# Altium schematic sheet MCU+GPIO.SchDoc
size 420 x 297 mm; SheetNumber: 1; SheetTotal: 2
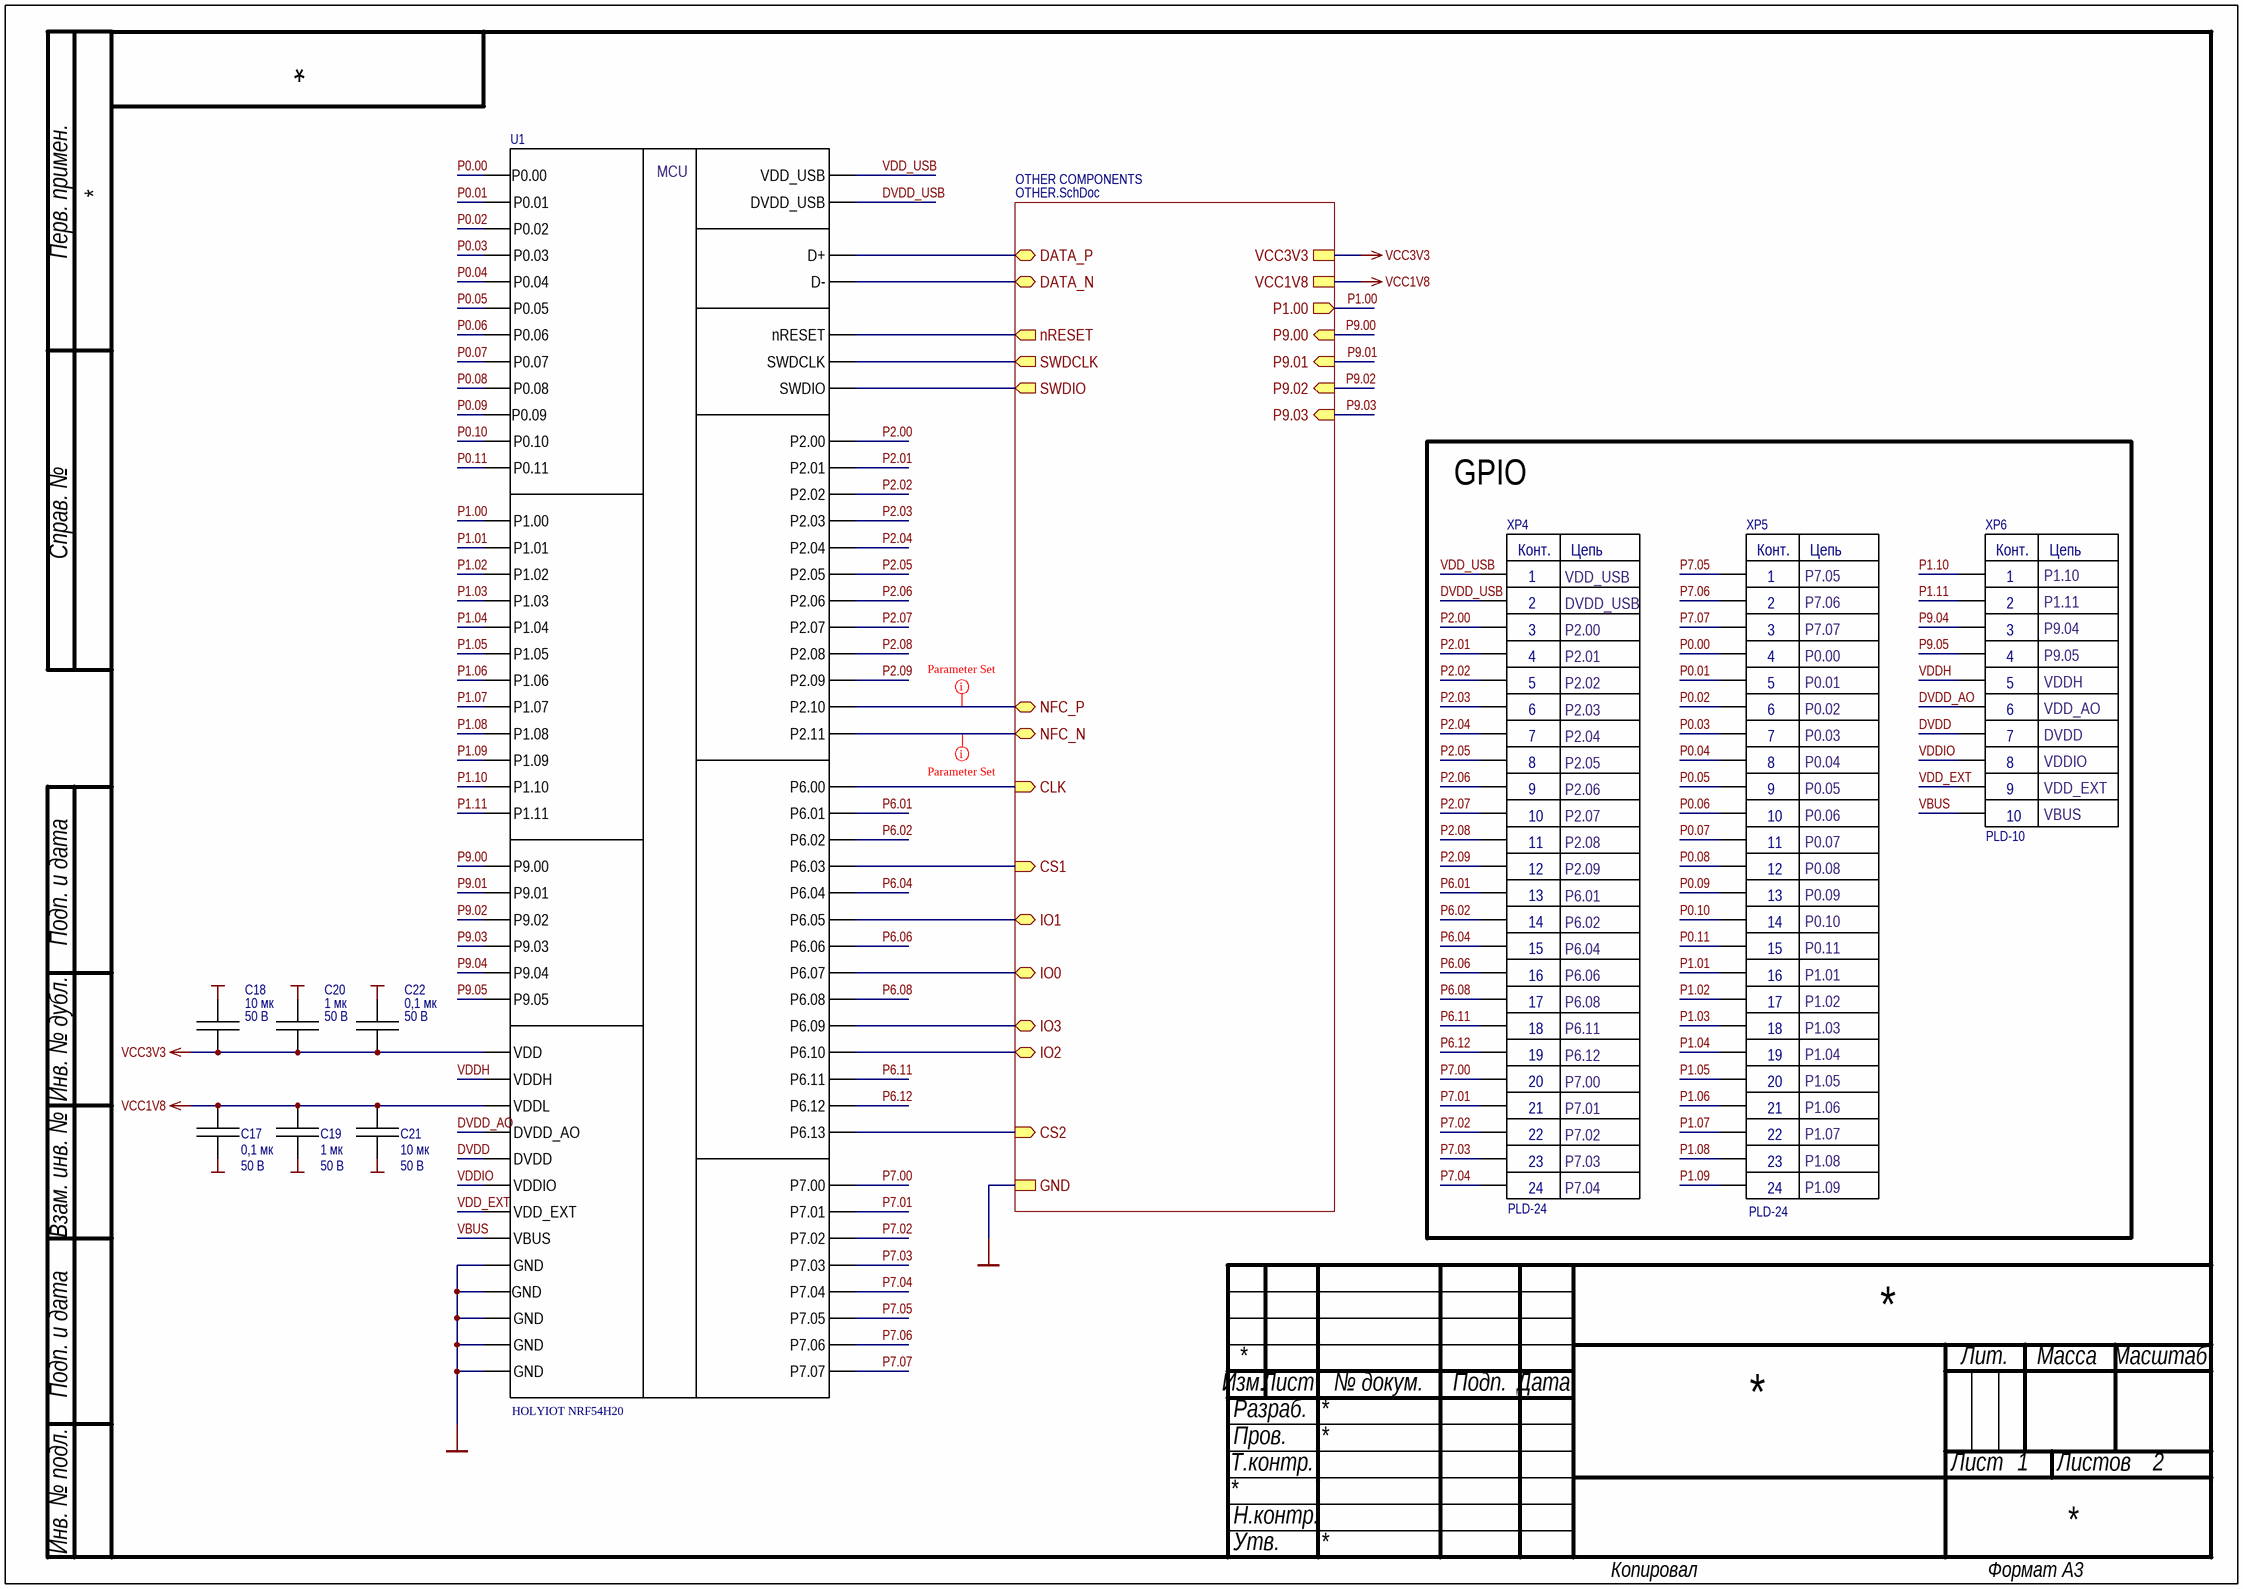
[diagram p0: MCU+GPIO.SchDoc]

## Parts
C17  value 0,1 мк  Rated voltage: 50 В  [C_0603_Manual_mount]  (hidden comment: GRM188R71H104KA93)
C18  value 10 мк  Rated voltage: 50 В  [C_1210_Manual_mount]  (hidden comment: GRM32ER61H106MA12)
C19  value 1 мк  Rated voltage: 50 В  [C_1206_Manual_mount]  (hidden comment: GRM31MR71H105KA88)
C20  value 1 мк  Rated voltage: 50 В  [C_1206_Manual_mount]  (hidden comment: GRM31MR71H105KA88)
C21  value 10 мк  Rated voltage: 50 В  [C_1210_Manual_mount]  (hidden comment: GRM32ER61H106MA12)
C22  value 0,1 мк  Rated voltage: 50 В  [C_0603_Manual_mount]  (hidden comment: GRM188R71H104KA93)
U1  HOLYIOT NRF54H20  [HOLYIOT NRF54H20]
XP4  PLD-24  [PLD-24]
XP5  PLD-24  [PLD-24]
XP6  PLD-10  [PLD-10]

## Blocks framed on the sheet
GPIO: XP4-XP6

## Sub-sheets
OTHER COMPONENTS = OTHER.SchDoc: DATA_P (bidir), DATA_N (bidir), NFC_N (bidir), NFC_P (bidir), SWDIO (out), SWDCLK (out), CLK (in), CS1 (in), CS2 (in), IO0 (bidir), IO1 (bidir), IO2 (bidir), IO3 (bidir), P1.00 (out), nRESET (out), P9.00 (in), P9.01 (in), P9.02 (in), P9.03 (in), GND, VCC3V3, VCC1V8

## Nets
GND: C17.2 C18.2 C19.2 C20.2 C21.2 C22.2 U1.1(GND) U1.4(GND) U1.28(GND) U1.29(GND) U1.58(GND) ; sheet OTHER COMPONENTS/GND
VCC1V8: C17.1 C19.1 C21.1 U1.55(VDDL) ; sheet OTHER COMPONENTS/VCC1V8
VCC3V3: C18.1 C20.1 C22.1 U1.3(VDD) ; sheet OTHER COMPONENTS/VCC3V3
DVDD: U1.5(DVDD) XP6.7
DVDD_AO: U1.6(DVDD_AO) XP6.6
DVDD_USB: U1.76(DVDD_USB) XP4.2
P0.00: U1.50(P0.00) XP5.4
P0.01: U1.68(P0.01) XP5.5
P0.02: U1.67(P0.02) XP5.6
P0.03: U1.66(P0.03) XP5.7
P0.04: U1.51(P0.04) XP5.8
P0.05: U1.45(P0.05) XP5.9
P0.06: U1.46(P0.06) XP5.10
P0.07: U1.47(P0.07) XP5.11
P0.08: U1.44(P0.08) XP5.12
P0.09: U1.43(P0.09) XP5.13
P0.10: U1.69(P0.10) XP5.14
P0.11: U1.70(P0.11) XP5.15
P1.00: U1.57(P1.00) ; sheet OTHER COMPONENTS/P1.00
P1.01: U1.56(P1.01) XP5.16
P1.02: U1.54(P1.02) XP5.17
P1.03: U1.53(P1.03) XP5.18
P1.04: U1.52(P1.04) XP5.19
P1.05: U1.84(P1.05) XP5.20
P1.06: U1.59(P1.06) XP5.21
P1.07: U1.60(P1.07) XP5.22
P1.08: U1.83(P1.08) XP5.23
P1.09: U1.61(P1.09) XP5.24
P1.10: U1.81(P1.10) XP6.1
P1.11: U1.82(P1.11) XP6.2
P2.00: U1.21(P2.00) XP4.3
P2.01: U1.22(P2.01) XP4.4
P2.02: U1.23(P2.02) XP4.5
P2.03: U1.24(P2.03) XP4.6
P2.04: U1.25(P2.04) XP4.7
P2.05: U1.34(P2.05) XP4.8
P2.06: U1.33(P2.06) XP4.9
P2.07: U1.32(P2.07) XP4.10
P2.08: U1.31(P2.08) XP4.11
P2.09: U1.30(P2.09) XP4.12
P6.01: U1.16(P6.01) XP4.13
P6.02: U1.17(P6.02) XP4.14
P6.04: U1.19(P6.04) XP4.15
P6.06: U1.14(P6.06) XP4.16
P6.08: U1.12(P6.08) XP4.17
P6.11: U1.9(P6.11) XP4.18
P6.12: U1.8(P6.12) XP4.19
P7.00: U1.42(P7.00) XP4.20
P7.01: U1.41(P7.01) XP4.21
P7.02: U1.40(P7.02) XP4.22
P7.03: U1.39(P7.03) XP4.23
P7.04: U1.38(P7.04) XP4.24
P7.05: U1.37(P7.05) XP5.1
P7.06: U1.36(P7.06) XP5.2
P7.07: U1.35(P7.07) XP5.3
P9.00: U1.48(P9.00) ; sheet OTHER COMPONENTS/P9.00
P9.01: U1.49(P9.01) ; sheet OTHER COMPONENTS/P9.01
P9.02: U1.65(P9.02) ; sheet OTHER COMPONENTS/P9.02
P9.03: U1.64(P9.03) ; sheet OTHER COMPONENTS/P9.03
P9.04: U1.63(P9.04) XP6.3
P9.05: U1.62(P9.05) XP6.4
VBUS: U1.77(VBUS) XP6.10
VDD_EXT: U1.75(VDD_EXT) XP6.9
VDD_USB: U1.80(VDD_USB) XP4.1
VDDH: U1.2(VDDH) XP6.5
VDDIO: U1.71(VDDIO) XP6.8
NetU1_7: U1.7(P6.13) ; sheet OTHER COMPONENTS/CS2
NetU1_10: U1.10(P6.10) ; sheet OTHER COMPONENTS/IO2
NetU1_11: U1.11(P6.09) ; sheet OTHER COMPONENTS/IO3
NetU1_13: U1.13(P6.07) ; sheet OTHER COMPONENTS/IO0
NetU1_15: U1.15(P6.00) ; sheet OTHER COMPONENTS/CLK
NetU1_18: U1.18(P6.03) ; sheet OTHER COMPONENTS/CS1
NetU1_20: U1.20(P6.05) ; sheet OTHER COMPONENTS/IO1
NetU1_26: U1.26(P2.11) ; sheet OTHER COMPONENTS/NFC_N
NetU1_27: U1.27(P2.10) ; sheet OTHER COMPONENTS/NFC_P
NetU1_72: U1.72(nRESET) ; sheet OTHER COMPONENTS/nRESET
NetU1_73: U1.73(SWDIO) ; sheet OTHER COMPONENTS/SWDIO
NetU1_74: U1.74(SWDCLK) ; sheet OTHER COMPONENTS/SWDCLK
NetU1_78: U1.78(D-) ; sheet OTHER COMPONENTS/DATA_N
NetU1_79: U1.79(D+) ; sheet OTHER COMPONENTS/DATA_P

## Layout directives
Импеданс: 50 Ом: NetU1_26, NetU1_27

## Notes on the sheet
- VDD_USB
- P7.05
- P1.10
- P2.01
- DVDD_USB
- P2.00
- P7.06
- P7.07
- P0.00
- P1.11
- P9.04
- P9.05
- P2.02
- P2.03
- P0.01
- P0.02
- VDDH
- VDD_AO
- P2.04
- P2.05
- P2.06
- P0.03
- P0.04
- P0.05
- DVDD
- VDDIO
- VDD_EXT
- P2.07
- P2.08
- P0.06
- P0.07
- VBUS
- P2.09
- P6.01
- P6.02
- P0.08
- P0.09
- P0.10
- P6.04
- P6.06
- P0.11
- P1.01
- P6.08
- P6.11
- P6.12
- P1.02
- P1.03
- P1.04
- P7.00
- P7.01
- P1.05
- P1.06
- P1.07
- P7.02
- P7.03
- P7.04
- P1.08
- P1.09
- Перв. примен.
- Справ. №
- Подп. и дата
- Инв. № дубл.
- Взам. инв. №
- Изм.
- Лист
- № докум.
- Подп.
- Дата
- Лит.
- Масса
- Масштаб
- Т.контр.
- Пров.
- Разраб.
- Листов
- Инв. № подл.
- Н.контр.
- Утв.
- Копировал
- Формат А3
- (in symbol HOLYIOT NRF54H20) MCU
- (in symbol PLD-10) Конт.; Цепь
- (in symbol PLD-24) Конт.; Цепь

## Library data of the parts
C17 C22 = GRM188R71H104KA93: Chip Monolithic Ceramic Capacitor; Manufacturer: Murata Manufacturing; Tolerance: 10 %; Temperature coefficient: ±15 %; Type: Конденсатор керамический; TC: X7R; Size: 0603; Temperature range: -55 ... 125 °C; Part Number: GRM188R71H104KA93
C18 C21 = GRM32ER61H106MA12: Chip Monolithic Ceramic Capacitor; Manufacturer: Murata Manufacturing; Tolerance: 20 %; Temperature coefficient: ±15 %; Type: Конденсатор керамический; TC: X5R; Size: 1210; Temperature range: -55 ... 85 °C; Part Number: GRM32ER61H106MA12
C19 C20 = GRM31MR71H105KA88: Chip Monolithic Ceramic Capacitor; Manufacturer: Murata Manufacturing; Tolerance: 10 %; Temperature coefficient: ±15 %; Type: Конденсатор керамический; TC: X7R; Size: 1206; Temperature range: -55 ... 125 °C; Part Number: GRM31MR71H105KA88
XP4 XP5 = PLD-24: PLD connector; Manufacturer: NONAME; Connector type: Вилка на плату; Number of contacts: 24; Type: Разъем штыревой
XP6 = PLD-10: PLD connector; Manufacturer: NONAME; Connector type: Вилка на плату; Number of contacts: 10; Type: Разъем штыревой